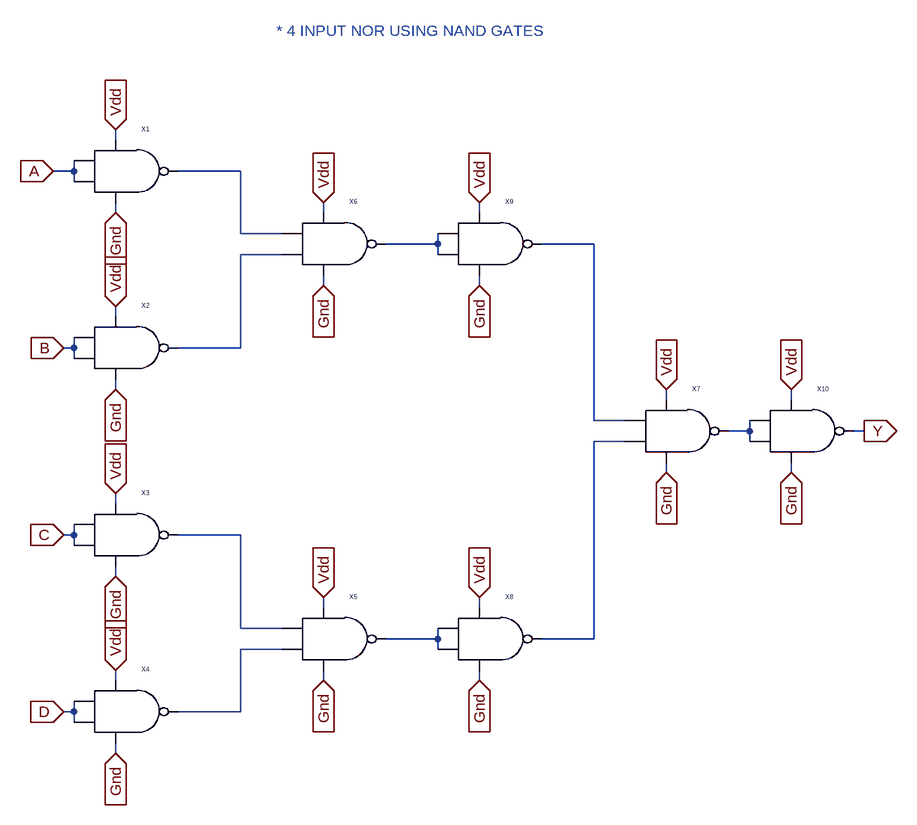
[diagram p0: schematic 4nor.asc]
4nor.asc, the LTspice schematic file:
Version 4
SHEET 1 1036 696
WIRE -208 -352 -208 -368
WIRE -272 -304 -272 -320
WIRE -272 -304 -304 -304
WIRE -16 -304 -112 -304
WIRE -272 -288 -272 -304
WIRE -208 -240 -208 -256
WIRE 112 -240 112 -256
WIRE 352 -240 352 -256
WIRE -16 -208 -16 -304
WIRE 48 -208 -16 -208
WIRE 288 -192 288 -208
WIRE 288 -192 208 -192
WIRE 528 -192 448 -192
WIRE 48 -176 -16 -176
WIRE 288 -176 288 -192
WIRE 112 -128 112 -144
WIRE 352 -128 352 -144
WIRE -208 -80 -208 -96
WIRE -272 -32 -272 -48
WIRE -272 -32 -288 -32
WIRE -16 -32 -16 -176
WIRE -16 -32 -112 -32
WIRE -272 -16 -272 -32
WIRE -208 32 -208 16
WIRE 640 48 640 32
WIRE 832 48 832 32
WIRE 528 80 528 -192
WIRE 576 80 528 80
WIRE 768 96 768 80
WIRE 768 96 736 96
WIRE 944 96 928 96
WIRE 576 112 528 112
WIRE 768 112 768 96
WIRE 640 160 640 144
WIRE 832 160 832 144
WIRE -208 208 -208 192
WIRE -272 256 -272 240
WIRE -272 256 -288 256
WIRE -16 256 -112 256
WIRE -272 272 -272 256
WIRE -208 320 -208 304
WIRE 112 368 112 352
WIRE 352 368 352 352
WIRE -16 400 -16 256
WIRE 48 400 -16 400
WIRE 288 416 288 400
WIRE 288 416 208 416
WIRE 528 416 528 112
WIRE 528 416 448 416
WIRE 48 432 -16 432
WIRE 288 432 288 416
WIRE -208 480 -208 464
WIRE 112 480 112 464
WIRE 352 480 352 464
WIRE -272 528 -272 512
WIRE -272 528 -288 528
WIRE -16 528 -16 432
WIRE -16 528 -112 528
WIRE -272 544 -272 528
WIRE -208 592 -208 576
FLAG -304 -304 A
IOPIN -304 -304 In
FLAG -288 -32 B
IOPIN -288 -32 In
FLAG -288 256 C
IOPIN -288 256 In
FLAG -288 528 D
IOPIN -288 528 In
FLAG -208 -368 Vdd
IOPIN -208 -368 In
FLAG -208 -96 Vdd
IOPIN -208 -96 In
FLAG -208 192 Vdd
IOPIN -208 192 In
FLAG -208 464 Vdd
IOPIN -208 464 In
FLAG 112 352 Vdd
IOPIN 112 352 In
FLAG 112 -256 Vdd
IOPIN 112 -256 In
FLAG 640 32 Vdd
IOPIN 640 32 In
FLAG 352 352 Vdd
IOPIN 352 352 In
FLAG 944 96 Y
IOPIN 944 96 Out
FLAG 352 -256 Vdd
IOPIN 352 -256 In
FLAG 352 -128 Gnd
IOPIN 352 -128 In
FLAG 640 160 Gnd
IOPIN 640 160 In
FLAG 352 480 Gnd
IOPIN 352 480 In
FLAG 112 480 Gnd
IOPIN 112 480 In
FLAG 112 -128 Gnd
IOPIN 112 -128 In
FLAG -208 -240 Gnd
IOPIN -208 -240 In
FLAG -208 320 Gnd
IOPIN -208 320 In
FLAG -208 592 Gnd
IOPIN -208 592 In
FLAG -208 32 Gnd
IOPIN -208 32 In
FLAG 832 32 Vdd
IOPIN 832 32 In
FLAG 832 160 Gnd
IOPIN 832 160 In
SYMBOL nand -208 -304 R0
SYMATTR InstName X1
SYMBOL nand -208 -32 R0
SYMATTR InstName X2
SYMBOL nand -208 256 R0
SYMATTR InstName X3
SYMBOL nand -208 528 R0
SYMATTR InstName X4
SYMBOL nand 112 416 R0
SYMATTR InstName X5
SYMBOL nand 112 -192 R0
SYMATTR InstName X6
SYMBOL nand 640 96 R0
SYMATTR InstName X7
SYMBOL nand 352 416 R0
SYMATTR InstName X8
SYMBOL nand 352 -192 R0
SYMATTR InstName X9
SYMBOL nand 832 96 R0
SYMATTR InstName X10
TEXT 40 -520 Left 2 ;* 4 INPUT NOR USING NAND GATES

The netlist it stands for:
* 4nor.asc
XX1 A A Vdd Gnd N001 nand  ; pins A B vdd gnd Y
XX2 B B Vdd Gnd N004 nand  ; pins A B vdd gnd Y
XX3 C C Vdd Gnd N007 nand  ; pins A B vdd gnd Y
XX4 D D Vdd Gnd N009 nand  ; pins A B vdd gnd Y
XX5 N007 N009 Vdd Gnd N008 nand  ; pins A B vdd gnd Y
XX6 N001 N004 Vdd Gnd N002 nand  ; pins A B vdd gnd Y
XX7 N003 N006 Vdd Gnd N005 nand  ; pins A B vdd gnd Y
XX8 N008 N008 Vdd Gnd N006 nand  ; pins A B vdd gnd Y
XX9 N002 N002 Vdd Gnd N003 nand  ; pins A B vdd gnd Y
XX10 N005 N005 Vdd Gnd Y nand  ; pins A B vdd gnd Y
* * 4 INPUT NOR USING NAND GATES
.backanno
.end